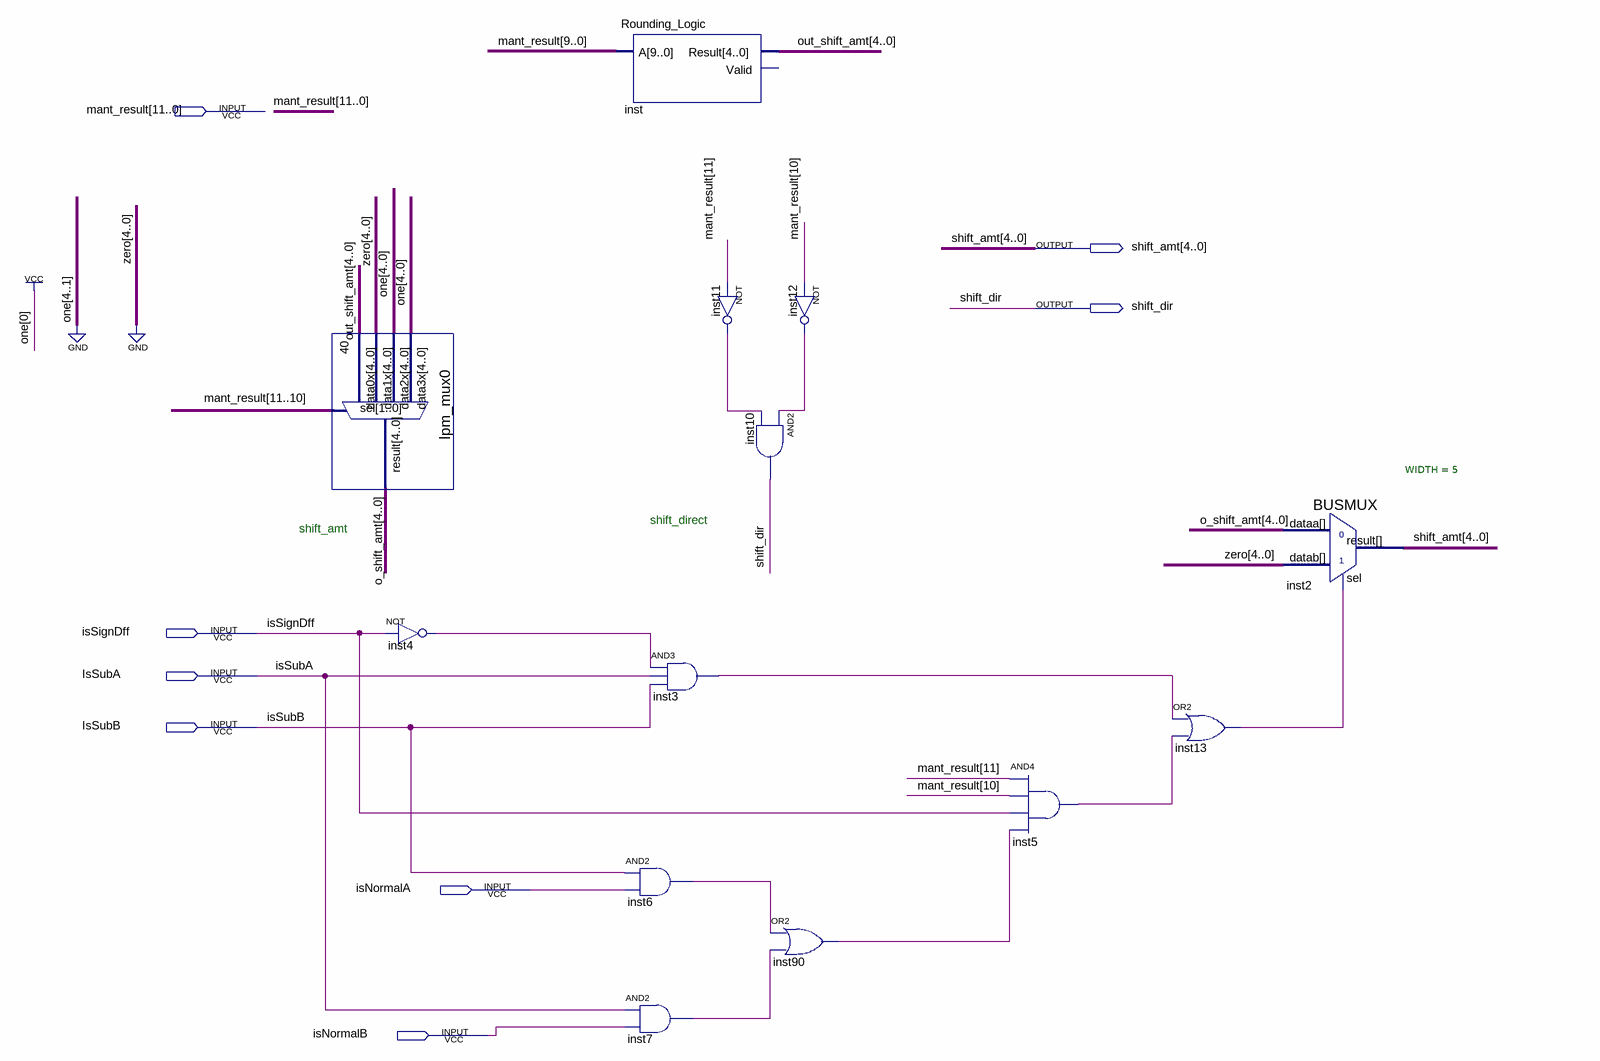
[diagram p0: schematic sheet]
// Quartus schematic normalize_control.bdf as structural Verilog: 13 symbols, 8 pins
module normalize_control (
  input  [11:0] mant_result,
  input  isSignDff,
  input  IsSubA,
  input  IsSubB,
  input  isNormalA,
  input  isNormalB,
  output [4:0] shift_amt,
  output shift_dir
);

  wire inst3_out, inst4_out, inst5_out, inst6_out, inst7_out, inst11_out, inst12_out, inst13_out, inst90_out;
  wire [4:0] o_shift_amt, out_shift_amt;

  lpm_mux0 u_40 (
    .data3x(5'b00001), .data2x(5'b00001), .data1x({5{1'b0}}), .data0x(out_shift_amt),
    .sel(mant_result[11:10]), .result(o_shift_amt));
  not inst4 (inst4_out, isSignDff);
  Rounding_Logic inst (.A(mant_result[9:0]), .Result(out_shift_amt));  // open: Valid
  and inst6 (inst6_out, IsSubB, isNormalA);
  and inst7 (inst7_out, IsSubA, isNormalB);
  and inst3 (inst3_out, inst4_out, IsSubA, IsSubB);
  not inst11 (inst11_out, mant_result[11]);
  and inst10 (shift_dir, inst12_out, inst11_out);
  not inst12 (inst12_out, mant_result[10]);
  or inst90 (inst90_out, inst6_out, inst7_out);
  and inst5 (inst5_out, mant_result[11], mant_result[10], isSignDff, inst90_out);
  or inst13 (inst13_out, inst3_out, inst5_out);
  BUSMUX #(.WIDTH(5)) inst2 (.datab({5{1'b0}}), .sel(inst13_out), .dataa(o_shift_amt), .result(shift_amt));

  // Notes on the sheet:
  //   shift_direct
  //   shift_amt
endmodule
